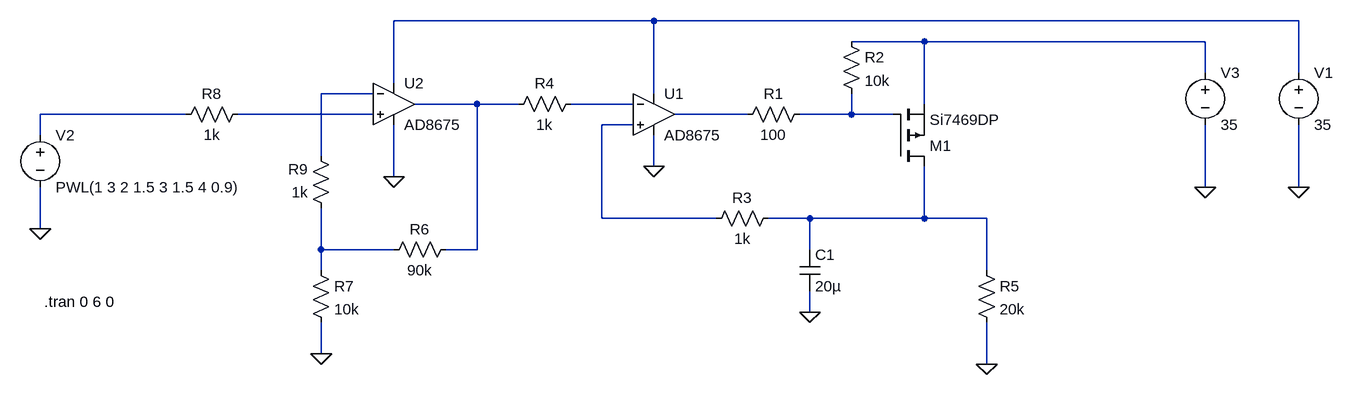
[diagram p0: schematic output_stage2_simuasc.asc]
output_stage2_simuasc.asc, the LTspice schematic file:
Version 4
SHEET 1 1444 680
WIRE 256 -224 -144 -224
WIRE 1248 -224 256 -224
WIRE 672 -192 560 -192
WIRE 1104 -192 672 -192
WIRE 1104 -144 1104 -192
WIRE 1248 -144 1248 -224
WIRE -144 -128 -144 -224
WIRE -176 -112 -256 -112
WIRE 256 -112 256 -224
WIRE -16 -96 -112 -96
WIRE 48 -96 -16 -96
WIRE 224 -96 128 -96
WIRE 672 -96 672 -192
WIRE -464 -80 -688 -80
WIRE -176 -80 -384 -80
WIRE 400 -80 288 -80
WIRE 560 -80 560 -112
WIRE 560 -80 480 -80
WIRE 624 -80 560 -80
WIRE 224 -64 176 -64
WIRE -688 -48 -688 -80
WIRE -256 -16 -256 -112
WIRE 256 0 256 -48
WIRE -144 16 -144 -64
WIRE 1104 32 1104 -64
WIRE 1248 32 1248 -64
WIRE 176 80 176 -64
WIRE 352 80 176 80
WIRE 496 80 432 80
WIRE 672 80 672 0
WIRE 672 80 496 80
WIRE 768 80 672 80
WIRE -688 96 -688 32
WIRE -256 128 -256 64
WIRE -144 128 -256 128
WIRE -16 128 -16 -96
WIRE -16 128 -64 128
WIRE 496 128 496 80
WIRE -256 160 -256 128
WIRE 768 160 768 80
WIRE 496 224 496 192
WIRE -256 288 -256 240
WIRE 768 304 768 240
FLAG 1248 32 0
FLAG -688 96 0
FLAG 256 0 0
FLAG 1104 32 0
FLAG 496 224 0
FLAG 768 304 0
FLAG -144 16 0
FLAG -256 288 0
SYMBOL pmos 624 0 M180
SYMATTR InstName M1
SYMATTR Value Si7469DP
SYMBOL voltage 1248 -160 R0
WINDOW 123 0 0 Left 0
WINDOW 39 0 0 Left 0
SYMATTR InstName V1
SYMATTR Value 35
SYMBOL res 496 -96 R90
WINDOW 0 0 56 VBottom 2
WINDOW 3 32 56 VTop 2
SYMATTR InstName R1
SYMATTR Value 100
SYMBOL voltage -688 -64 R0
WINDOW 123 0 0 Left 0
WINDOW 39 0 0 Left 0
SYMATTR InstName V2
SYMATTR Value PWL(1 3 2 1.5 3 1.5 4 0.9)
SYMBOL OpAmps\\AD8675 256 -144 R0
SYMATTR InstName U1
SYMBOL res 544 -208 R0
SYMATTR InstName R2
SYMATTR Value 10k
SYMBOL voltage 1104 -160 R0
WINDOW 123 0 0 Left 0
WINDOW 39 0 0 Left 0
SYMATTR InstName V3
SYMATTR Value 35
SYMBOL res 448 64 R90
WINDOW 0 0 56 VBottom 2
WINDOW 3 32 56 VTop 2
SYMATTR InstName R3
SYMATTR Value 1k
SYMBOL cap 480 128 R0
SYMATTR InstName C1
SYMATTR Value 20µ
SYMBOL res 752 144 R0
SYMATTR InstName R5
SYMATTR Value 20k
SYMBOL OpAmps\\AD8675 -144 -160 R0
SYMATTR InstName U2
SYMBOL res 144 -112 R90
WINDOW 0 0 56 VBottom 2
WINDOW 3 32 56 VTop 2
SYMATTR InstName R4
SYMATTR Value 1k
SYMBOL res -48 112 R90
WINDOW 0 0 56 VBottom 2
WINDOW 3 32 56 VTop 2
SYMATTR InstName R6
SYMATTR Value 90k
SYMBOL res -272 144 R0
SYMATTR InstName R7
SYMATTR Value 10k
SYMBOL res -368 -96 R90
WINDOW 0 0 56 VBottom 2
WINDOW 3 32 56 VTop 2
SYMATTR InstName R8
SYMATTR Value 1k
SYMBOL res -240 80 R180
WINDOW 0 36 76 Left 2
WINDOW 3 36 40 Left 2
SYMATTR InstName R9
SYMATTR Value 1k
TEXT -682 208 Left 2 !.tran 0 6 0

The netlist it stands for:
* output_stage2_simuasc.asc
M1 N011 N009 N002 N002 Si7469DP
V1 N001 0 35
R1 N009 N008 100
V2 N006 0 PWL(1 3 2 1.5 3 1.5 4 0.9)
XU1 N010 N005 N001 0 N008 AD8675  ; pins In+ In- V+ V- OUT
R2 N002 N009 10k
V3 N002 0 35
R3 N011 N010 1k
C1 N011 0 20µ
R5 N011 0 20k
XU2 N007 N003 N001 0 N004 AD8675  ; pins In+ In- V+ V- OUT
R4 N005 N004 1k
R6 N004 N012 90k
R7 N012 0 10k
R8 N007 N006 1k
R9 N012 N003 1k
.model NMOS NMOS
.model PMOS PMOS
.lib standard.mos
.tran 0 6 0
.backanno
.end